# EAGLE schematic stopduino (EAGLE 5.10)
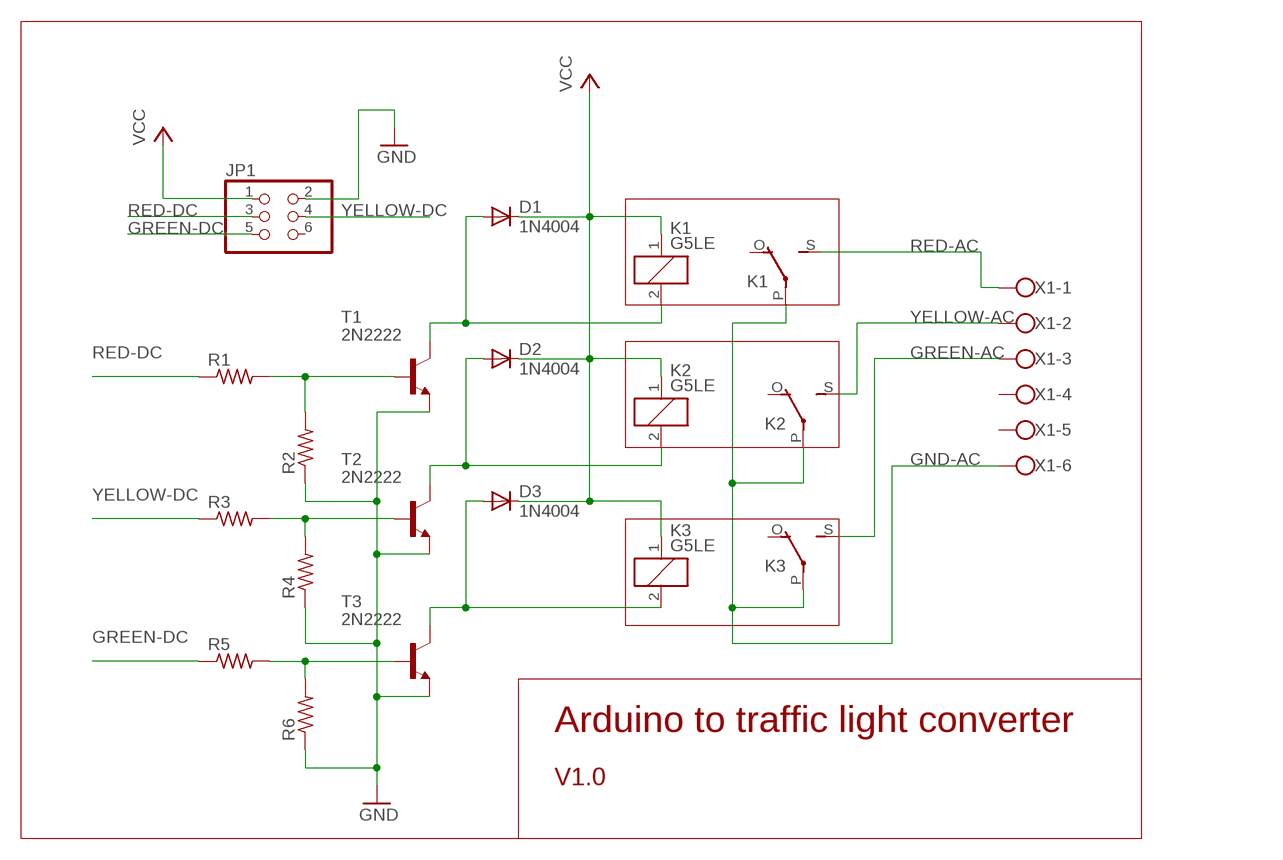
[diagram p0: schematic, sheet 1]

## Parts
D1  1N4004  [DO41-10]
D2  1N4004  [DO41-10]
D3  1N4004  [DO41-10]
JP1  PINHD-2X3  [2X03]
K1  G5LE  [G5LE]
K2  G5LE  [G5LE]
K3  G5LE  [G5LE]
R1  R-US_0207/10  [0207/10]
R2  R-US_0207/10  [0207/10]
R3  R-US_0207/10  [0207/10]
R4  R-US_0207/10  [0207/10]
R5  R-US_0207/10  [0207/10]
R6  R-US_0207/10  [0207/10]
T1  2N2222  [TO92-EBC-OVAL]
T2  2N2222  [TO92-EBC-OVAL]
T3  2N2222  [TO92-EBC-OVAL]
X1  W237-6  [W237-6]

## Nets
GND: JP1.2 R2.1 R4.1 R6.1 T1.E T2.E T3.E
GND-AC: K1.P(2:P) K2.P(2:P) K3.P(2:P) X1.6
GREEN-AC: K3.S(2:S) X1.3
GREEN-DC: JP1.5 R5.1
N$2: D3.A K3.2 T3.C
N$3: D2.A K2.2 T2.C
N$4: D1.A K1.2 T1.C
N$5: R5.2 R6.2 T3.B
N$6: R1.2 R2.2 T1.B
N$7: R3.2 R4.2 T2.B
RED-AC: K1.S(2:S) X1.1
RED-DC: JP1.3 R1.1
VCC: D1.C D2.C D3.C JP1.1 K1.1 K2.1 K3.1
YELLOW-AC: K2.S(2:S) X1.2
YELLOW-DC: JP1.4 R3.1
Unconnected: JP1.6 K1.O(2:O) K2.O(2:O) K3.O(2:O) X1.4 X1.5

## Notes on the sheet
- Arduino to traffic light converter
- V1.0

## Library data of the parts
D1-D3 = adafruit:1N4004: DIODE General purpose 1N400x type rectifier (With bigger pads) http://www.ladyada.net/library/pcb/eaglelibrary.html
JP1 = pinhead:PINHD-2X3: PIN HEADER
K1-K3 = relay:G5LE: RELAY 1 x switch, 10 A/120 V AC, 8 A/30 V DC, Omron; OC_FARNELL: unknown; OC_NEWARK: unknown
R1-R6 = adafruit:R-US_: RESISTOR, American symbol
T1-T3 = adafruit:2N2222: NPN TRANSISTOR Big oval pads
X1 = con-wago-500:W237-6: WAGO SCREW CLAMP; OC_FARNELL: unknown; OC_NEWARK: unknown